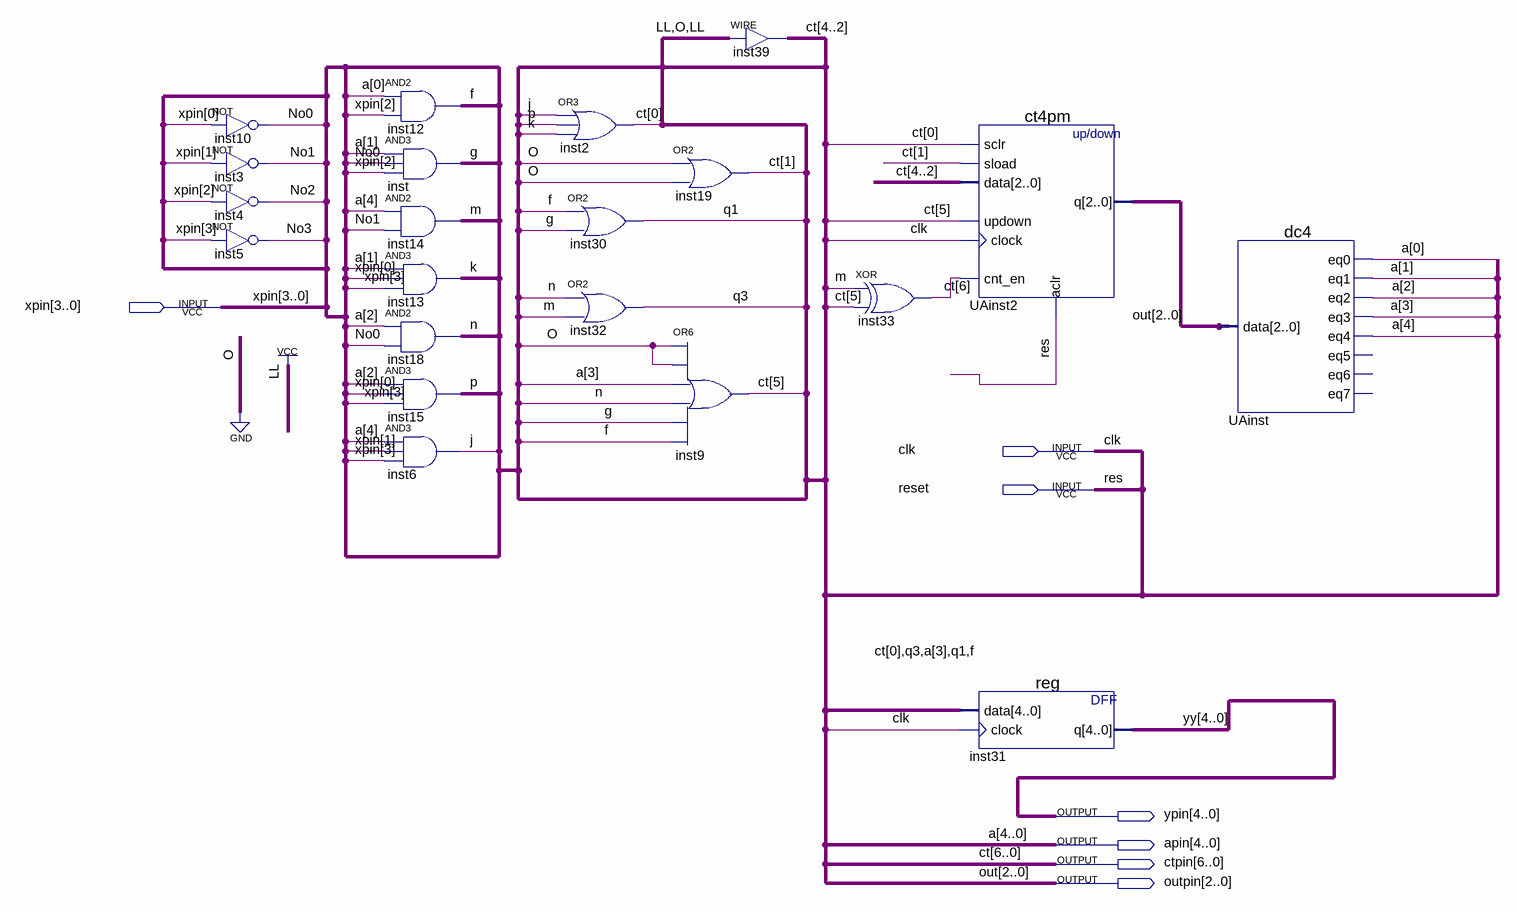
[diagram p0: schematic sheet]
// Quartus schematic UAcourseProject.bdf as structural Verilog: 21 symbols, 7 pins
module UAcourseProject (
  input  [3:0] xpin,
  input  clk,
  input  reset,
  output [4:0] ypin,
  output [4:0] apin,
  output [6:0] ctpin,
  output [2:0] outpin
);

  wire f, g, j, k, m, n, No0, No1, No2, No3, p, q1, q3;

  not inst10 (No0, xpin[0]);
  not inst3 (No1, xpin[1]);
  not inst4 (No2, xpin[2]);
  not inst5 (No3, xpin[3]);
  and inst12 (f, apin[0], xpin[2]);
  and inst (g, apin[1], No0, xpin[2]);
  and inst14 (m, apin[4], No1);
  and inst13 (k, apin[1], xpin[0], xpin[3]);
  and inst18 (n, apin[2], No0);
  and inst15 (p, apin[2], xpin[0], xpin[3]);
  and inst6 (j, apin[4], xpin[1], xpin[3]);
  or inst2 (ctpin[0], j, p, k);
  or inst30 (q1, f, g);
  or inst32 (q3, n, m);
  or inst19 (ctpin[1], 1'b0, 1'b0);
  or inst9 (ctpin[5], 1'b0, 1'b0, apin[3], n, g, f);
  assign ctpin[4:2] = 3'b101;  // WIRE inst39
  xor inst33 (ctpin[6], m, ctpin[5]);
  ct4pm UAinst2 (
    .sclr(ctpin[0]), .sload(ctpin[1]), .data(ctpin[4:2]), .updown(ctpin[5]), .clock(clk), .cnt_en(ctpin[6]),
    .aclr(reset), .q(outpin));
  \reg  inst31 (.data({ctpin[0], q3, apin[3], q1, f}), .clock(clk), .q(ypin));
  dc4 UAinst (
    .data(outpin), .eq0(apin[0]), .eq1(apin[1]), .eq2(apin[2]), .eq3(apin[3]), .eq4(apin[4]));  // open: eq5, eq6, eq7

  // Other names for the same wires on the sheet: a[4:0] = apin; ct[6:0] = ctpin; out[2:0] = outpin; res = reset;
  //   yy[4:0] = ypin
endmodule
